# Altium schematic sheet Power.SchDoc
size A4
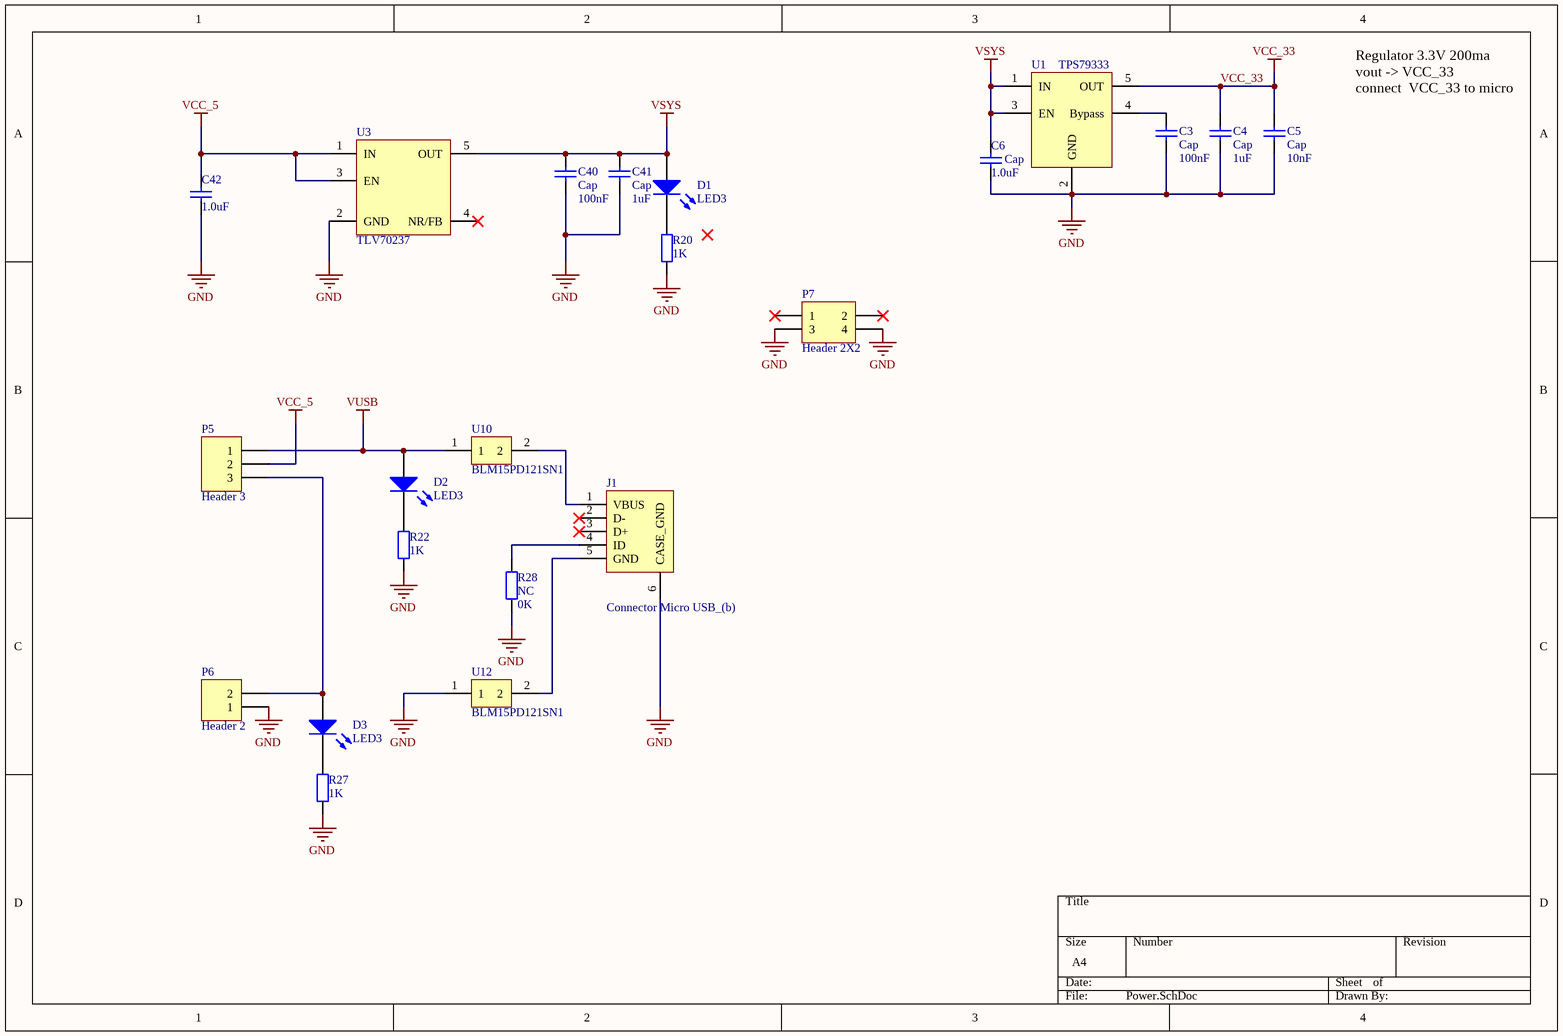
[diagram p0: Power.SchDoc]

## Parts
C3  Cap  value 100nF  [cap_0402_R - modified]
C4  Cap  value 1uF  [cap_0402_R - modified]
C5  Cap  value 10nF  [cap_0402_R - modified]
C6  Cap  value 1.0uF  [cap_0402_R - modified]
C40  Cap  value 100nF  [cap_0402_R - modified]
C41  Cap  value 1uF  [cap_0402_R - modified]
C42  value 1.0uF  [cap_0402_R - modified]  (hidden comment: Cap)
D1  LED3  [0603]
D2  LED3  [0603]
D3  LED3  [0603]
J1  Connector Micro USB_(b)  [CONNECTOR_MICRO_USB_B_TYPE]
P5  Header 3  [HDR1X3]
P6  Header 2  [HDR1X2]
P7  Header 2X2  [HDR2X2]
R20  value 1K  [0603]  (hidden comment: R)
R22  value 1K  [0603]  (hidden comment: R)
R27  value 1K  [0603]  (hidden comment: R)
R28  NC  value 0K  [cap_0402_R - modified]
U1  TPS79333  [SOT_23__DBV_(R - PDSO - G5)]
U3  TLV70237  [SOT23__DDC__(R - PDSO-  G5)]
U10  BLM15PD121SN1  [BLM15PD121SN1]
U12  BLM15PD121SN1  [BLM15PD121SN1]

## Nets
GND: C3.1 C4.2 C5.1 C6.1 C40.1 C41.2 C42.1 J1.6(CASE_GND) P6.1 P7.3 P7.4 R20.1 R22.1 R27.1 R28.1 U1.2(GND) U3.2(GND) U12.1
VCC_5: C42.2 P5.2 U3.1(IN) U3.3(EN)
VCC_33: C4.1 C5.2 U1.5(OUT)
VSYS: C6.2 C40.2 C41.1 D1.1(A) U1.1(IN) U1.3(EN) U3.5(OUT)
VUSB: D2.1(A) P5.1 U10.1
NetC3_2: C3.2 U1.4(Bypass)
NetD1_2: D1.2(K) R20.2
NetD2_2: D2.2(K) R22.2
NetD3_1: D3.1(A) P5.3 P6.2
NetD3_2: D3.2(K) R27.2
NetJ1_1: J1.1(VBUS) U10.2
NetJ1_4: J1.4(ID) R28.2
NetJ1_5: J1.5(GND) U12.2

Not connected (* = marked no-connect by the designer): J1 2(D-)* 3(D+)*; P7 1* 2*; U3 4(NR/FB)*

## Notes on the sheet
- Regulator 3.3V 200ma
  vout -> VCC_33
  connect  VCC_33 to micro

## Library data of the parts
C3-C6 C40-C42 = Cap: Capacitor; Published: 8-Jun-2000; LatestRevisionDate: 17-Jul-2002; LatestRevisionNote: Re-released for DXP Platform.; PackageReference: RAD-0.3; Publisher: Altium Limited; PackageDescription: Radial Cap, Thru-Hole; 2 Leads; 0.3 in Pin Spacing
D1-D3 = LED3: Typical BLUE SiC LED; Published: 8-Jun-2000; LatestRevisionDate: 17-Dec-2003; LatestRevisionNote: PCB Footprint replaced.; DatasheetVersion: 16-Apr-2002; PackageVersion: 16-Apr-2002; PackageReference: 3.5X2.8X1.9; Publisher: Altium Limited; PackageDescription: SM LED; 2 C-Bend Leads; Body 3.5 x 2.8 x 1.9 mm, inc leads (LxWxH typ)
J1 = Connector Micro USB_(b): CONNECTOR MICRO USB
P5 = Header 3: Header, 3-Pin; LatestRevisionDate: 17-Jul-2002; LatestRevisionNote: Re-released for DXP Platform.; Publisher: Altium Limited
P6 = Header 2: Header, 2-Pin; LatestRevisionDate: 17-Jul-2002; LatestRevisionNote: Re-released for DXP Platform.; Publisher: Altium Limited
P7 = Header 2X2: Header, 2-Pin, Dual row; LatestRevisionDate: 17-Jul-2002; LatestRevisionNote: Re-released for DXP Platform.; Publisher: Altium Limited
R20 R22 R27 R28 = Res2: Resistor; Published: 8-Jun-2000; LatestRevisionDate: 17-Jul-2002; LatestRevisionNote: Re-released for DXP Platform.; PackageReference: AXIAL-0.4; Publisher: Altium Limited; PackageDescription: Axial Device, Thru-Hole; 2 Leads; 0.4 in Pin Spacing
U1 = TPS79333: Regulator
U3 = TLV70237: Linear Regulator